# Altium project Electronic_Load.PrjPcb
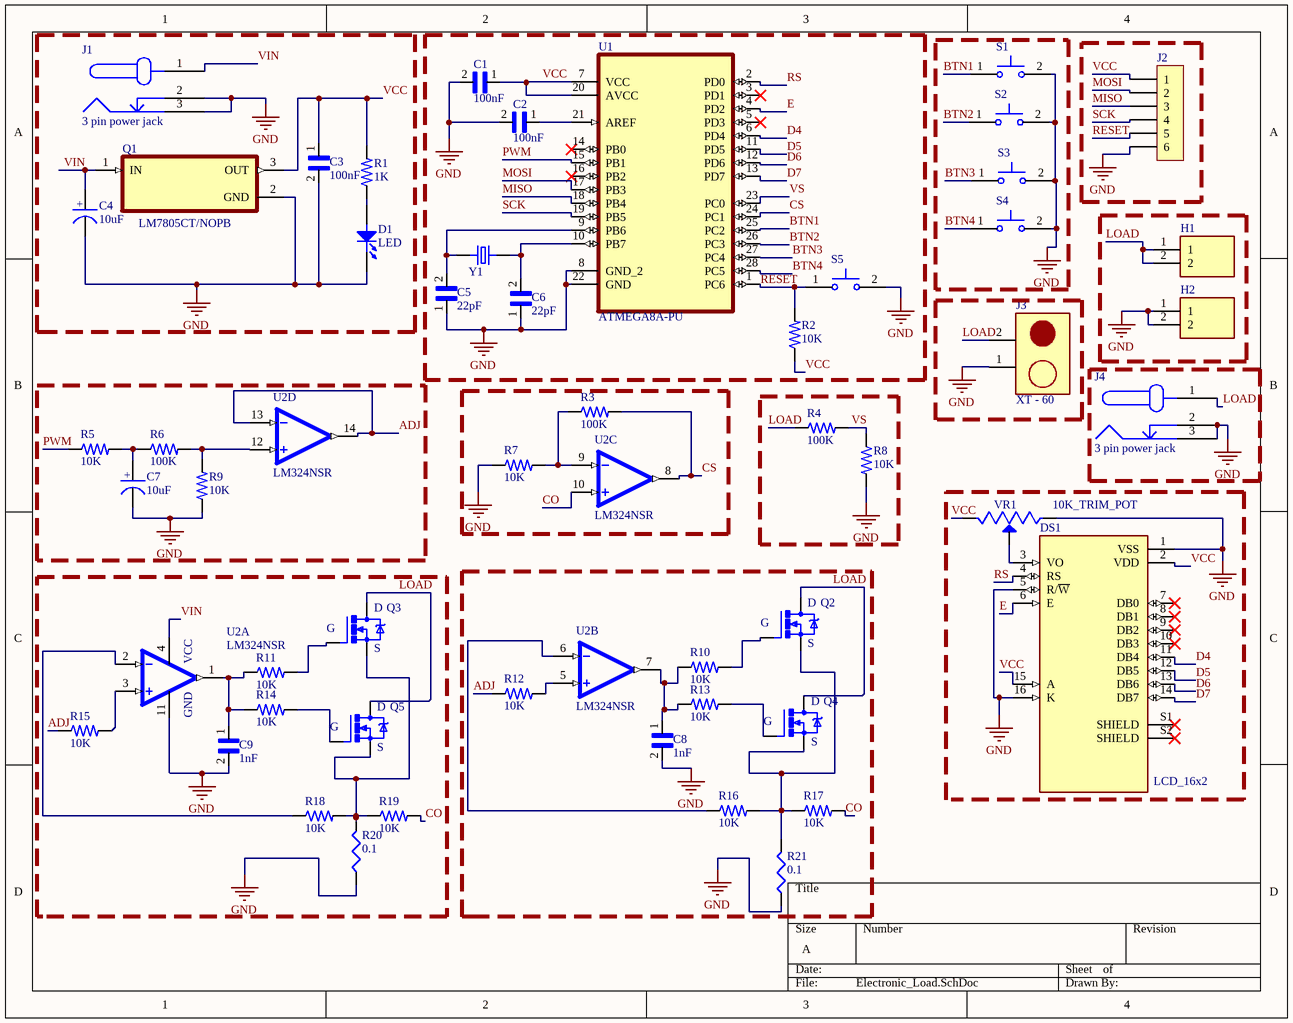
[diagram p0: Electronic_Load.SchDoc]
1 sheet, 52 parts. Net scope: global (net labels, ports and power ports of the same name join across sheets).
Board file: Electronic_Load_1.PcbDoc

## Sheet Electronic_Load.SchDoc
size A; SheetNumber: 1; SheetTotal: 1

### Parts
C1  100nF  [Cap_nonpolarized_2.5mm]
C2  100nF  [Cap_nonpolarized_2.5mm]
C3  100nF  [Cap_nonpolarized_2.5mm]
C4  10uF  [CP_Radial_D4.0mm_P1.50mm]
C5  22pF  [Cap_nonpolarized_2.5mm]
C6  22pF  [Cap_nonpolarized_2.5mm]
C7  10uF  [CP_Radial_D4.0mm_P1.50mm]
C8  1nF  [Cap_nonpolarized_2.5mm]
C9  1nF  [Cap_nonpolarized_2.5mm]
D1  LED  [LED_TH_2.54mm]
DS1  LCD_16x2  [LCD_16x2]
H1  Terminal PCB Male Flat 6.3mm  [Terminal PCB Male Flat 6.3mm]  (value not drawn)
H2  Terminal PCB Male Flat 6.3mm  [Terminal PCB Male Flat 6.3mm]  (value not drawn)
J1  3 pin power jack  [DC_POWER_JACK_2.7MM]
J2  6 pin socket  [Jst - XH - 6pins]  (value not drawn)
J3  XT - 60  [XT-60]
J4  3 pin power jack  [DC_POWER_JACK_2.7MM]
Q1  LM7805CT/NOPB  [TO254P1054X470X1955-3]
Q2  NTP30N06L  [NTP30N06L]  (value not drawn)
Q3  NTP30N06L  [NTP30N06L]  (value not drawn)
Q4  NTP30N06L  [NTP30N06L]  (value not drawn)
Q5  NTP30N06L  [NTP30N06L]  (value not drawn)
R1  1K  [resistor_through hole]
R2  10K  [resistor_through hole]
R3  100K  [resistor_through hole]
R4  100K  [resistor_through hole]
R5  10K  [resistor_through hole]
R6  100K  [resistor_through hole]
R7  10K  [resistor_through hole]
R8  10K  [resistor_through hole]
R9  10K  [resistor_through hole]
R10  10K  [resistor_through hole]
R11  10K  [resistor_through hole]
R12  10K  [resistor_through hole]
R13  10K  [resistor_through hole]
R14  10K  [resistor_through hole]
R15  10K  [resistor_through hole]
R16  10K  [resistor_through hole]
R17  10K  [resistor_through hole]
R18  10K  [resistor_through hole]
R19  10K  [resistor_through hole]
R20  0.1  [2W_resistor_through hole]
R21  0.1  [2W_resistor_through hole]
S1  BUTT-2  [SW_BUTT-2]  (value not drawn)
S2  BUTT-2  [SW_BUTT-2]  (value not drawn)
S3  BUTT-2  [SW_BUTT-2]  (value not drawn)
S4  BUTT-2  [SW_BUTT-2]  (value not drawn)
S5  BUTT-2  [SW_BUTT-2]  (value not drawn)
U1  ATMEGA8A-PU  [ATMEGA8A-PU]
U2  LM324NSR  [DIP794W45P254L1969H508Q14]  (parts A,B,C,D of 4)
VR1  10K_TRIM_POT  [TRIM_3296W-OT1-103LF]
Y1  ECS-160-20-4X-DU  [XTAL_ECS-160-20-4X-DU]  (value not drawn)

### Nets
GND: C1.2 C2.2 C3.2 C4.2(Negative) C5.1 C6.1 C7.2(Negative) C8.2 C9.2 D1.2(Negative) DS1.1(VSS) DS1.5(R/~{W}) DS1.16(K) H2.1 H2.2 J1.2 J1.3 J2.6 J3.1(+) J4.2 J4.3 Q1.2(GND) R7.1 R8.2 R9.1 R20.1 R21.1 S1.2 S2.2 S3.2 S4.2 S5.2 U1.8(GND_2) U1.22(GND) U2.11(GND) VR1.1(CCW)
ADJ: R12.1 R15.1 U2.13(4IN-) U2.14(4OUT)
BTN1: S1.1 U1.25(PC2)
BTN2: S2.1 U1.26(PC3)
BTN3: S3.1 U1.27(PC4)
BTN4: S4.1 U1.28(PC5)
CO: R17.2 R19.2 U2.10(3IN+)
CS: R3.2 U1.24(PC1) U2.8(3OUT)
D4: DS1.11(DB4) U1.6(PD4)
D5: DS1.12(DB5) U1.11(PD5)
D6: DS1.13(DB6) U1.12(PD6)
D7: DS1.14(DB7) U1.13(PD7)
E: DS1.6(E) U1.4(PD2)
LOAD: H1.1 H1.2 J3.2(-) J4.1 Q2.2(D) Q3.2(D) Q4.2(D) Q5.2(D) R4.1
MISO: J2.3 U1.18(PB4)
MOSI: J2.2 U1.17(PB3)
PWM: R5.1 U1.15(PB1)
RESET: J2.5 R2.2 S5.1 U1.1(PC6)
RS: DS1.4(RS) U1.2(PD0)
SCK: J2.4 U1.19(PB5)
VCC: C1.1 C3.1 DS1.2(VDD) DS1.15(A) J2.1 Q1.3(OUT) R1.2 R2.1 U1.7(VCC) U1.20(AVCC) VR1.3(CW)
VIN: C4.1(Positive) J1.1 Q1.1(IN) U2.4(VCC)
VS: R4.2 R8.1 U1.23(PC0)
NetC2_1: C2.1 U1.21(AREF)
NetC5_2: C5.2 U1.9(PB6) Y1.2
NetC6_2: C6.2 U1.10(PB7) Y1.1
NetC7_1: C7.1(Positive) R5.2 R6.1
NetC8_1: C8.1 R10.1 R13.1 U2.7(2OUT)
NetC9_1: C9.1 R11.1 R14.1 U2.1(1OUT)
NetD1_1: D1.1(Positive) R1.1
NetDS1_3: DS1.3(VO) VR1.2(WIPER)
NetQ2_1: Q2.1(G) R10.2
NetQ2_3: Q2.3(S) Q4.3(S) R16.2 R17.1 R21.2
NetQ3_1: Q3.1(G) R11.2
NetQ3_3: Q3.3(S) Q5.3(S) R18.2 R19.1 R20.2
NetQ4_1: Q4.1(G) R13.2
NetQ5_1: Q5.1(G) R14.2
NetR3_1: R3.1 R7.2 U2.9(3IN-)
NetR6_2: R6.2 R9.2 U2.12(4IN+)
NetR12_2: R12.2 U2.5(2IN+)
NetR15_2: R15.2 U2.3(1IN+)
NetR16_1: R16.1 U2.6(2IN-)
NetR18_1: R18.1 U2.2(1IN-)

Not connected (* = marked no-connect by the designer): DS1 7(DB0)* 8(DB1)* 9(DB2)* 10(DB3)* S1(SHIELD)* S2(SHIELD)*; U1 3(PD1)* 5(PD3)* 14(PB0)* 16(PB2)*

### Notes on the sheet
- (in symbol Polarized capacitors) +

### Library data of the parts
C1-C3 C5 C6 C8 C9 = CAP1206: ceramic cap; MP: GRM31CC80E157ME11K; MF: Murata; Price: None; Availability: In Stock; Package: 1206 Murata; Value: *; SnapEDA_Link: https://www.snapeda.com/parts/GRM31CC80E157ME11K/Murata/view-part/?ref=snap; Purchase-URL: https://pricing.snapeda.com/search/part/GRM31CC80E157ME11K/?ref=eda; Check_prices: https://www.snapeda.com/parts/GRM31CC80E157ME11K/Murata/view-part/?ref=eda
C4 C7 = Polarized capacitors: Generial polarized capacitor for through hole or SMD capacitors
DS1 = LCD_16x2: Display: LCD; alphanumeric; STN Negative; 16x2; blue; LED; PIN: 16; MF: Raystar; MP: RC1602B-BIW-CSV; Value: *; SnapEDA_Link: https://www.snapeda.com/parts/RC1602B-BIW-CSV/Raystar/view-part/?ref=snap; Availability: Not in stock; Price: None; Package: None; Check_prices: https://www.snapeda.com/parts/RC1602B-BIW-CSV/Raystar/view-part/?ref=eda
H1 H2 = Terminal PCB Male Flat 6.3mm: PCR250 - Valcon PCB Mount Spade Terminal, 12.1mm PCB Profile; Package: None; Value: *; MP: PCR250; Availability: Unavailable; Price: None
J1 J4 = DC Power Jack: DC Power Jack / generic 3 pins connector
J2 = Jst - XH -6pins
Q2-Q5 = NTP30N06L: N-Channel 100 V 9.2A (Tc) 3.7W (Ta), 60W (Tc) Surface Mount D2PAK; MP: IRF520; MF: Vishay Siliconix; Check_prices: https://www.snapeda.com/parts/IRF520/Vishay+Siliconix/view-part/?ref=eda; Value: *; Availability: In Stock; Price: None; Package: TO-220-3 Vishay; SnapEDA_Link: https://www.snapeda.com/parts/IRF520/Vishay+Siliconix/view-part/?ref=snap; Purchase-URL: https://pricing.snapeda.com/search/part/IRF520/?ref=eda
R1-R19 = 1206_RESISTOR: RES 0.24 OHM 1% 1/4W 1206; Resistance: 24; Power_Rating: .25 W; MF: TE Connectivity; MP: 2-1879462-9; Package: 1206; Value: *; Price: None; Availability: Unavailable; SnapEDA_Link: https://www.snapeda.com/parts/2-1879462-9/TE%20Connectivity/view-part/2213899/?ref=snap; EU_RoHS_Compliance: Compliant with Exemptions; Tolerance: 1%
R20 R21 = US_Resistor: Generial resistor for through hole or SMD resistors
S1-S5 = BUTT-2: Tactile Switches MINI PUSH BUTTON SWITCH 2-PIN QTY. 4; MF: Gravitech; Purchase-URL: https://pricing.snapeda.com/search/part/BUTT-2/?ref=eda; Package: None; Value: *; Check_prices: https://www.snapeda.com/parts/BUTT-2/Gravitech/view-part/?ref=eda; SnapEDA_Link: https://www.snapeda.com/parts/BUTT-2/Gravitech/view-part/?ref=snap; Availability: In Stock; Price: None; MP: BUTT-2
U1 = ATMEGA8A-PU: AVR AVRÂ® ATmega Microcontroller IC 8-Bit 16MHz 8KB (4K x 16) FLASH 28-PDIP; MF: Microchip; Check_prices: https://www.snapeda.com/parts/ATMEGA8A-PU/Microchip/view-part/?ref=eda; Value: *; Availability: Unavailable; MP: ATMEGA8A-PU; Price: None; Package: PDIP-28; SnapEDA_Link: https://www.snapeda.com/parts/ATMEGA8A-PU/Microchip/view-part/?ref=snap
U2 = LM324NSR: 4-Channel industry standard operational amplifier 14-SO 0 to 70; MF: Texas Instruments; SnapEDA_Link: https://www.snapeda.com/parts/LM324NSR/Texas%20Instruments/view-part/1807/?ref=snap; Availability: Warning; Package: SOP-14 Texas Instruments; Price: None; MP: LM324NSR; Check_prices: https://www.snapeda.com/parts/LM324NSR/Texas%20Instruments/view-part/1807/?ref=eda; Value: *; Purchase-URL: https://pricing.snapeda.com/search/part/LM324NSR/?ref=eda
VR1 = 3296W-OT1-103LF: Trimmer Resistors - Through Hole 3/8 SQ CERMET 10K SEALED TRIM POT; MF: Bourns; SnapEDA_Link: https://www.snapeda.com/parts/3296W-OT1-103LF/Bourns/view-part/?ref=snap; Package: None; Value: *; MP: 3296W-OT1-103LF; Check_prices: https://www.snapeda.com/parts/3296W-OT1-103LF/Bourns/view-part/?ref=eda
Y1 = ECS-160-20-4X-DU: 16MHz Â±30ppm Crystal 20pF 40 Ohms HC-49/US; MF: ECS Inc.; Digi-Key_Part_Number: XC1925-ND; Digi-Key_Purchase_URL: https://www.digikey.com/product-detail/en/ecs-inc/ECS-160-20-4X-DU/XC1925-ND/2781930?utm_source=snapeda&utm_medium=aggregator&utm_campaign=symbol; Package: HC-49/US ECS International; MP: ECS-160-20-4X-DU; Value: *; SnapEDA_Link: https://www.snapeda.com/parts/ECS-160-20-4X-DU/ECS%20Inc./view-part/2154532/?ref=snap
Q1 = LM7805CT/NOPB: Price: None; MP: LM7805CT/NOPB; Availability: Unavailable; Value: *; Package: None